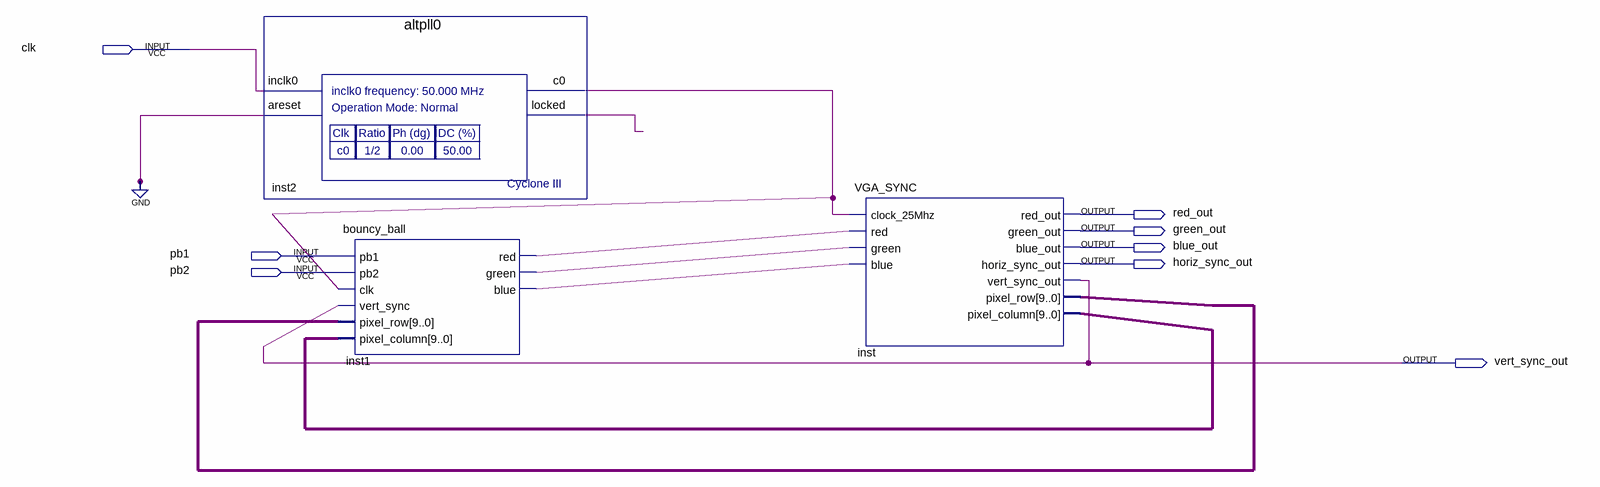
[diagram p0: schematic sheet]
// Quartus schematic miniProject2.bdf as structural Verilog: 3 symbols, 8 pins
module miniProject2 (
  input  clk,
  input  pb1,
  input  pb2,
  output red_out,
  output green_out,
  output blue_out,
  output horiz_sync_out,
  output vert_sync_out
);

  wire inst1_blue, inst1_green, inst1_red, inst2_c0, inst2_locked;
  wire [9:0] inst_pixel_column, inst_pixel_row;

  altpll0 inst2 (.inclk0(clk), .areset(1'b0), .c0(inst2_c0), .locked(inst2_locked));
  bouncy_ball inst1 (
    .pb1(pb1), .pb2(pb2), .clk(inst2_c0), .vert_sync(vert_sync_out), .pixel_row(inst_pixel_row),
    .pixel_column(inst_pixel_column), .red(inst1_red), .green(inst1_green), .blue(inst1_blue));
  VGA_SYNC inst (
    .clock_25Mhz(inst2_c0), .red(inst1_red), .green(inst1_green), .blue(inst1_blue), .red_out(red_out),
    .green_out(green_out), .blue_out(blue_out), .horiz_sync_out(horiz_sync_out),
    .vert_sync_out(vert_sync_out), .pixel_row(inst_pixel_row), .pixel_column(inst_pixel_column));
endmodule
